# EAGLE schematic PanelWireGuide (EAGLE 9.6.2)
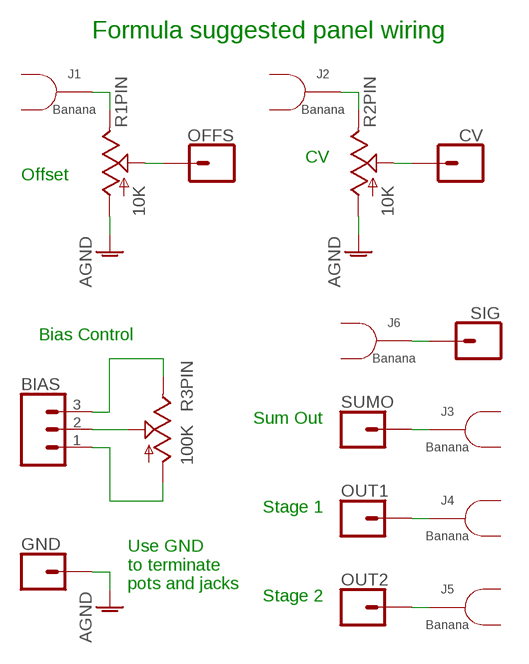
[diagram p0: schematic, sheet 1]

## Parts
BIAS  3XWIREPAD  [1X03]
CV  1XWIREPAD  [1X01]
GND  1XWIREPAD  [1X01]
J1  BANANA_SOCKET_PAD  [BANANA_PCB_PAD]
J2  BANANA_SOCKET_PAD  [BANANA_PCB_PAD]
J3  BANANA_SOCKET_PAD  [BANANA_PCB_PAD]
J4  BANANA_SOCKET_PAD  [BANANA_PCB_PAD]
J5  BANANA_SOCKET_PAD  [BANANA_PCB_PAD]
J6  BANANA_SOCKET_PAD  [BANANA_PCB_PAD]
OFFS  1XWIREPAD  [1X01]
OUT1  1XWIREPAD  [1X01]
OUT2  1XWIREPAD  [1X01]
R1  10K  POTENTIOMETER  [ALPHA_RV09_9MMPOT]
R2  10K  POTENTIOMETER  [ALPHA_RV09_9MMPOT]
R3  100K  POTENTIOMETER  [ALPHA_RV09_9MMPOT]
SIG  1XWIREPAD  [1X01]
SUMO  1XWIREPAD  [1X01]

## Nets
AGND: GND.1 R1.C1(PIN:A) R2.C1(PIN:A)
N$1: J1.P$2 R1.C3(PIN:B)
N$2: OFFS.1 R1.C2(PIN:W)
N$3: J2.P$2 R2.C3(PIN:B)
N$4: CV.1 R2.C2(PIN:W)
N$5: BIAS.2 R3.C2(PIN:W)
N$6: BIAS.3 R3.C3(PIN:B)
N$7: BIAS.1 R3.C1(PIN:A)
N$8: J6.P$2 SIG.1
N$9: J3.P$2 SUMO.1
N$10: J4.P$2 OUT1.1
N$11: J5.P$2 OUT2.1
Unconnected: R1.LUGL R1.LUGR R2.LUGL R2.LUGR R3.LUGL R3.LUGR

## Notes on the sheet
- Formula suggested panel wiring
- CV
- Offset
- Bias Control
- Sum Out
- Stage 1
- Use GND
  to terminate
  pots and jacks
- Stage 2

## Library data of the parts
BIAS = ElectricNoodleBox:3XWIREPAD
CV GND OFFS OUT1 OUT2 SIG SUMO = ElectricNoodleBox:1XWIREPAD
J1-J6 = ElectricNoodleBox:BANANA_SOCKET_PAD
R1-R3 = ElectricNoodleBox:POTENTIOMETER